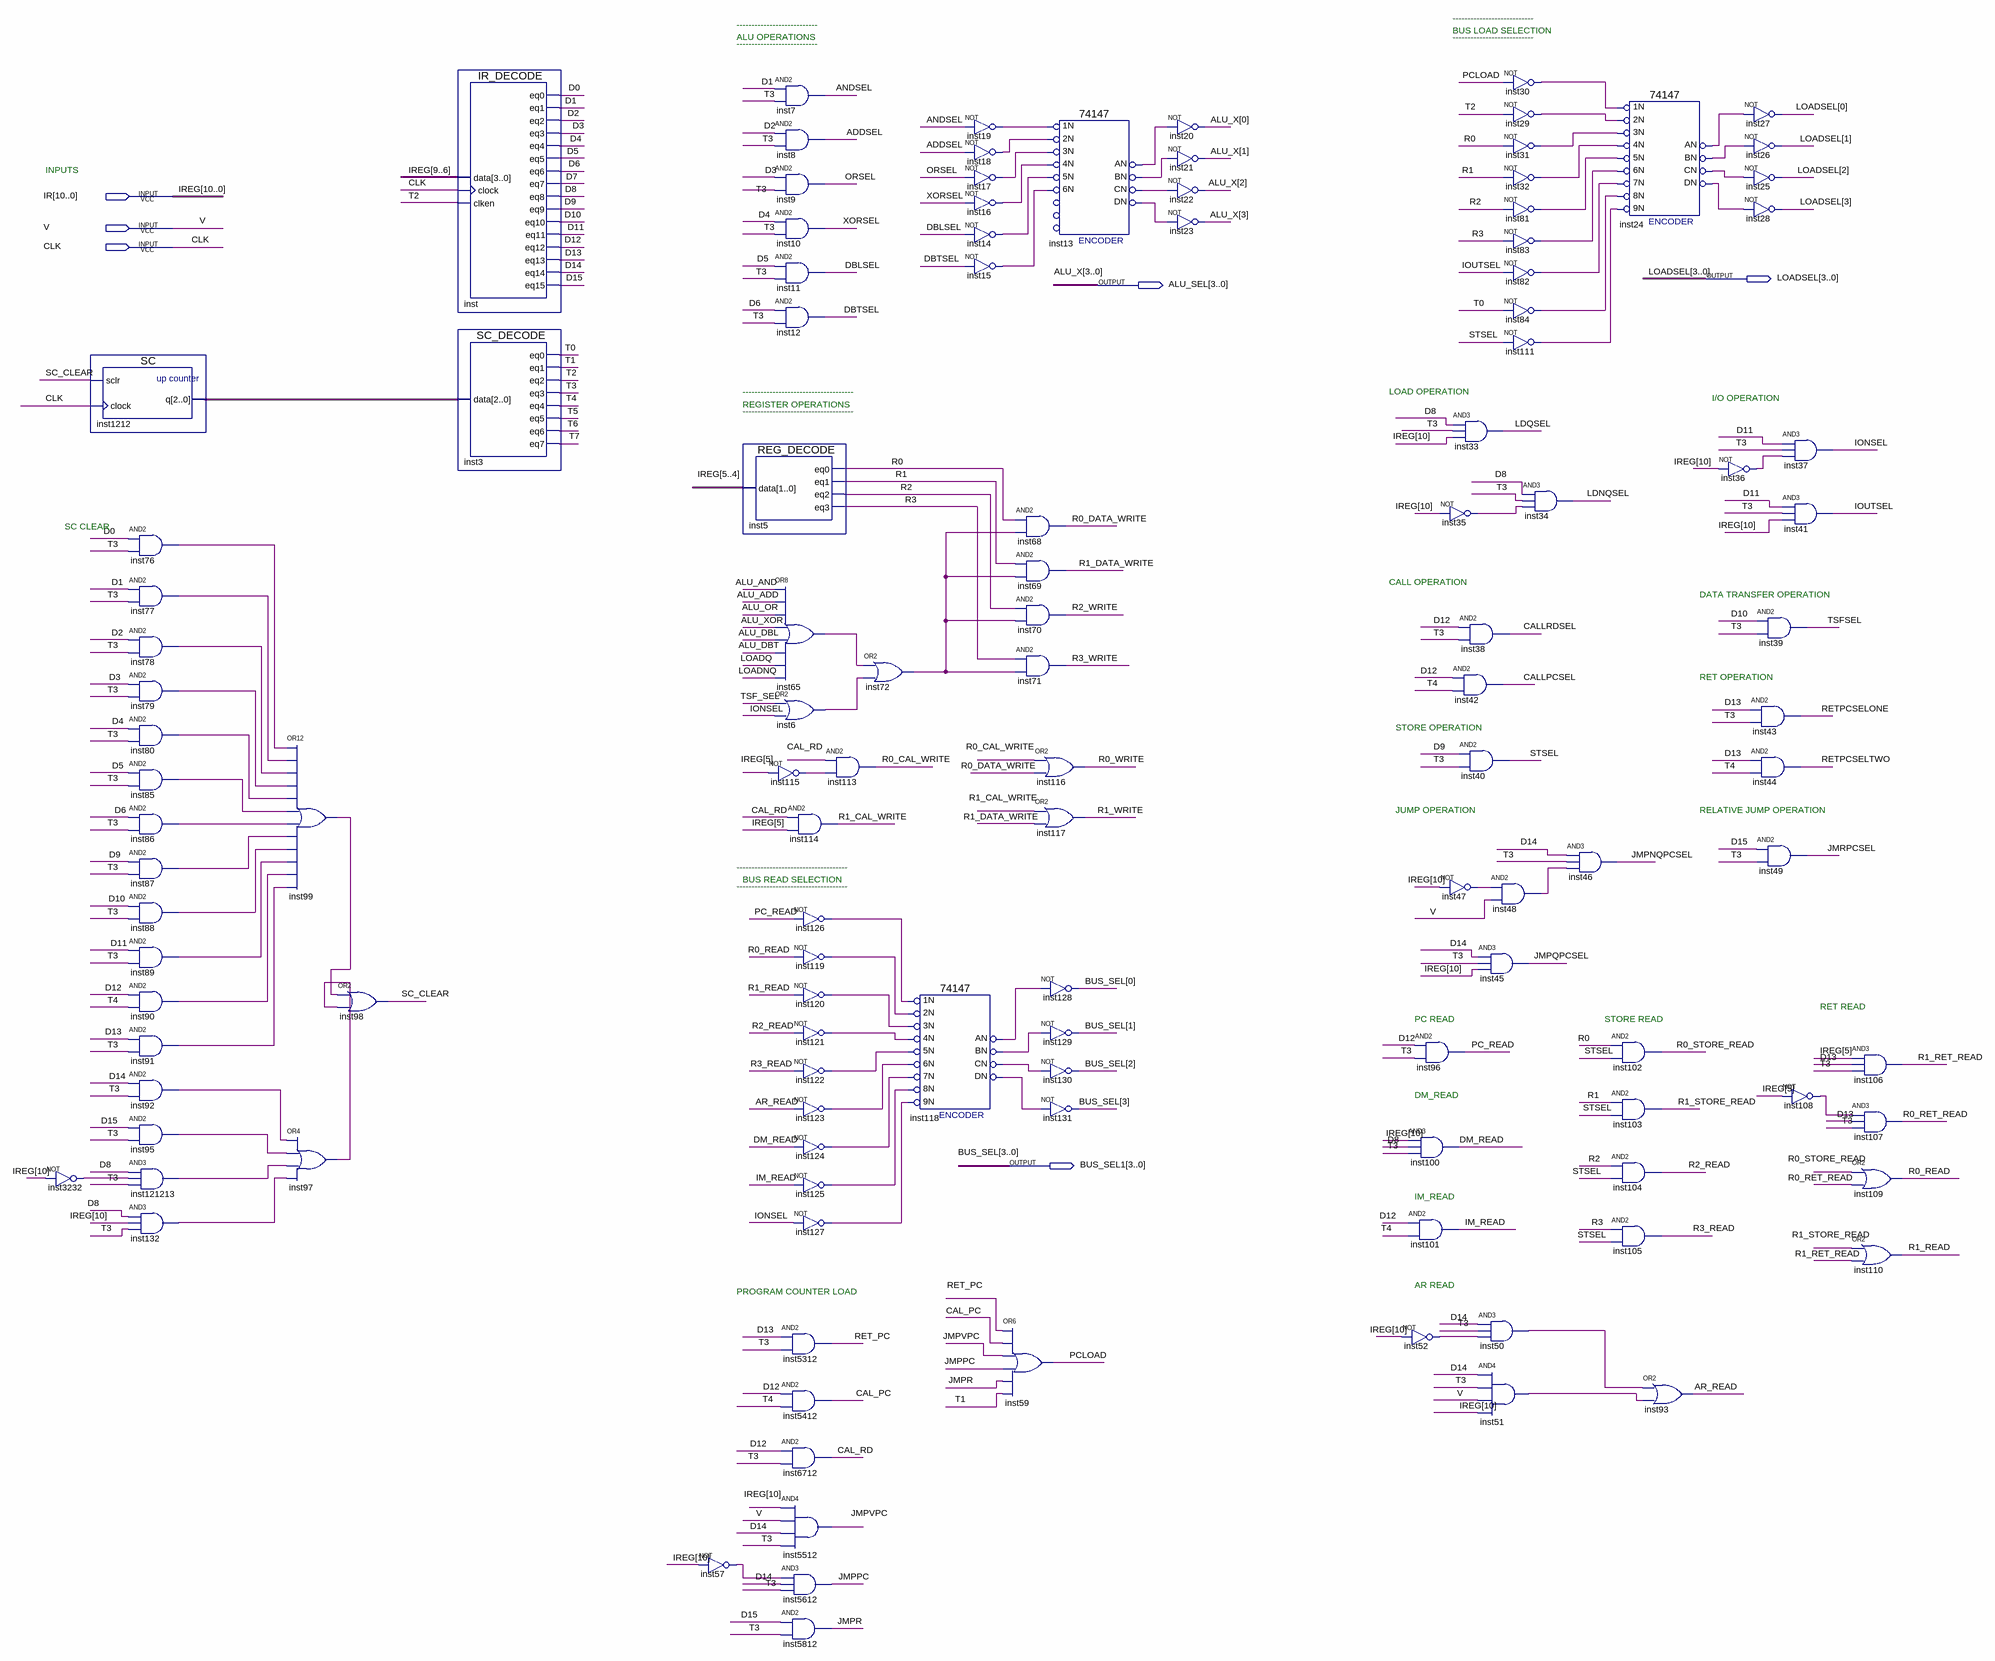
[diagram p0: schematic sheet]
// Quartus schematic ControlUnit.bdf as structural Verilog: 122 symbols, 6 pins
module ControlUnit (
  input  [10:0] IR,
  input  V,
  input  CLK,
  output [3:0] LOADSEL,
  output [3:0] ALU_SEL,
  output [3:0] BUS_SEL1
);

  wire ADDSEL, ALU_ADD, ALU_AND, ALU_DBL, ALU_DBT, ALU_OR, ALU_XOR, ANDSEL, AR_READ, CAL_PC, CAL_RD,
       CALLPCSEL, CALLRDSEL, D0, D1, D2, D3, D4, D5, D6, D7, D8, D9, D10, D11, D12, D13, D14, D15, DBLSEL,
       DBTSEL, DM_READ, IM_READ, inst6_out, inst13_an, inst13_bn, inst13_cn, inst13_dn, inst14_out,
       inst15_out, inst16_out, inst17_out, inst18_out, inst19_out, inst24_an, inst24_bn, inst24_cn,
       inst24_dn, inst29_out, inst30_out, inst31_out, inst32_out, inst35_out, inst36_out, inst47_out,
       inst48_out, inst50_out, inst51_out, inst52_out, inst57_out, inst65_out, inst72_out, inst76_out,
       inst77_out, inst78_out, inst79_out, inst80_out, inst81_out, inst82_out, inst83_out, inst84_out,
       inst85_out, inst86_out, inst87_out, inst88_out, inst89_out, inst90_out, inst91_out, inst92_out,
       inst95_out, inst97_out, inst99_out, inst108_out, inst111_out, inst115_out, inst118_an, inst118_bn,
       inst118_cn, inst118_dn, inst119_out, inst120_out, inst121_out, inst122_out, inst123_out, inst124_out,
       inst125_out, inst126_out, inst127_out, inst132_out, inst3232_out, inst121213_out, IONSEL, IOUTSEL,
       JMPNQPCSEL, JMPPC, JMPQPCSEL, JMPR, JMPVPC, JMRPCSEL, LDNQSEL, LDQSEL, LOADNQ, LOADQ, ORSEL, PC_READ,
       PCLOAD, R0, R0_CAL_WRITE, R0_DATA_WRITE, R0_READ, R0_RET_READ, R0_STORE_READ, R0_WRITE, R1,
       R1_CAL_WRITE, R1_DATA_WRITE, R1_READ, R1_RET_READ, R1_STORE_READ, R1_WRITE, R2, R2_READ, R2_WRITE, R3,
       R3_READ, R3_WRITE, RET_PC, RETPCSELONE, RETPCSELTWO, SC_CLEAR, STSEL, T0, T1, T2, T3, T4, T5, T6, T7,
       TSF_SEL, TSFSEL, XORSEL;
  wire [2:0] inst1212_q;

  not inst3232 (inst3232_out, IR[10]);
  SC inst1212 (.sclr(SC_CLEAR), .clock(CLK), .q(inst1212_q));
  and inst76 (inst76_out, D0, T3);
  and inst77 (inst77_out, D1, T3);
  and inst78 (inst78_out, D2, T3);
  and inst79 (inst79_out, D3, T3);
  and inst80 (inst80_out, D4, T3);
  and inst85 (inst85_out, D5, T3);
  and inst86 (inst86_out, D6, T3);
  and inst87 (inst87_out, D9, T3);
  and inst88 (inst88_out, D10, T3);
  and inst89 (inst89_out, D11, T3);
  and inst90 (inst90_out, D12, T4);
  and inst91 (inst91_out, D13, T3);
  and inst92 (inst92_out, D14, T3);
  and inst95 (inst95_out, D15, T3);
  and inst121213 (inst121213_out, D8, inst3232_out, T3);
  and inst132 (inst132_out, D8, IR[10], T3);
  or inst99 (inst99_out, inst76_out, inst77_out, inst78_out, inst79_out, inst80_out, inst85_out, inst86_out, inst87_out, inst88_out, inst89_out, inst90_out, inst91_out);
  or inst97 (inst97_out, inst92_out, inst95_out, inst121213_out, inst132_out);
  or inst98 (SC_CLEAR, inst99_out, inst97_out);
  IR_DECODE inst (
    .data(IR[9:6]), .clock(CLK), .clken(T2), .eq0(D0), .eq1(D1), .eq2(D2), .eq3(D3), .eq4(D4), .eq5(D5),
    .eq6(D6), .eq7(D7), .eq8(D8), .eq9(D9), .eq10(D10), .eq11(D11), .eq12(D12), .eq13(D13), .eq14(D14),
    .eq15(D15));
  SC_DECODE inst3 (.data(inst1212_q), .eq0(T0), .eq1(T1), .eq2(T2), .eq3(T3), .eq4(T4), .eq5(T5), .eq6(T6), .eq7(T7));
  not inst57 (inst57_out, IR[10]);
  REG_DECODE inst5 (.data(IR[5:4]), .eq0(R0), .eq1(R1), .eq2(R2), .eq3(R3));
  and inst7 (ANDSEL, D1, T3);
  and inst8 (ADDSEL, D2, T3);
  and inst9 (ORSEL, D3, T3);
  and inst10 (XORSEL, D4, T3);
  and inst11 (DBLSEL, D5, T3);
  and inst12 (DBTSEL, D6, T3);
  or inst65 (inst65_out, ALU_AND, ALU_ADD, ALU_OR, ALU_XOR, ALU_DBL, ALU_DBT, LOADQ, LOADNQ);
  or inst6 (inst6_out, TSF_SEL, IONSEL);
  not inst115 (inst115_out, IR[5]);
  and inst114 (R1_CAL_WRITE, CAL_RD, IR[5]);
  not inst126 (inst126_out, PC_READ);
  not inst119 (inst119_out, R0_READ);
  not inst120 (inst120_out, R1_READ);
  not inst121 (inst121_out, R2_READ);
  not inst122 (inst122_out, R3_READ);
  not inst123 (inst123_out, AR_READ);
  not inst124 (inst124_out, DM_READ);
  not inst125 (inst125_out, IM_READ);
  not inst127 (inst127_out, IONSEL);
  and inst5312 (RET_PC, D13, T3);
  and inst5412 (CAL_PC, D12, T4);
  and inst6712 (CAL_RD, D12, T3);
  and inst5512 (JMPVPC, IR[10], V, D14, T3);
  and inst5612 (JMPPC, inst57_out, D14, T3);
  and inst5812 (JMPR, D15, T3);
  and inst113 (R0_CAL_WRITE, CAL_RD, inst115_out);
  or inst72 (inst72_out, inst65_out, inst6_out);
  \74147  inst118 (
    .\1N (inst126_out), .\2N (inst119_out), .\3N (inst120_out), .\6N (inst123_out), .\5N (inst122_out),
    .\4N (inst121_out), .\9N (inst127_out), .\8N (inst125_out), .\7N (inst124_out), .CN(inst118_cn),
    .BN(inst118_bn), .AN(inst118_an), .DN(inst118_dn));
  not inst19 (inst19_out, ANDSEL);
  not inst18 (inst18_out, ADDSEL);
  not inst17 (inst17_out, ORSEL);
  not inst16 (inst16_out, XORSEL);
  not inst14 (inst14_out, DBLSEL);
  not inst15 (inst15_out, DBTSEL);
  or inst59 (PCLOAD, RET_PC, CAL_PC, JMPVPC, JMPPC, JMPR, T1);
  \74147  inst13 (
    .\1N (inst19_out), .\2N (inst18_out), .\3N (inst17_out), .\4N (inst16_out), .\5N (inst14_out),
    .\6N (inst15_out), .AN(inst13_an), .BN(inst13_bn), .CN(inst13_cn), .DN(inst13_dn));
  and inst68 (R0_DATA_WRITE, R0, inst72_out);
  and inst69 (R1_DATA_WRITE, R1, inst72_out);
  and inst70 (R2_WRITE, R2, inst72_out);
  and inst71 (R3_WRITE, R3, inst72_out);
  or inst116 (R0_WRITE, R0_CAL_WRITE, R0_DATA_WRITE);
  or inst117 (R1_WRITE, R1_CAL_WRITE, R1_DATA_WRITE);
  not inst128 (BUS_SEL1[0], inst118_an);
  not inst129 (BUS_SEL1[1], inst118_bn);
  not inst130 (BUS_SEL1[2], inst118_cn);
  not inst131 (BUS_SEL1[3], inst118_dn);
  not inst20 (ALU_SEL[0], inst13_an);
  not inst21 (ALU_SEL[1], inst13_bn);
  not inst22 (ALU_SEL[2], inst13_cn);
  not inst23 (ALU_SEL[3], inst13_dn);
  and inst96 (PC_READ, D12, T3);
  and inst100 (DM_READ, IR[10], D8, T3);
  and inst101 (IM_READ, D12, T4);
  not inst52 (inst52_out, IR[10]);
  and inst33 (LDQSEL, D8, T3, IR[10]);
  not inst35 (inst35_out, IR[10]);
  and inst38 (CALLRDSEL, D12, T3);
  and inst42 (CALLPCSEL, D12, T4);
  and inst40 (STSEL, D9, T3);
  not inst47 (inst47_out, IR[10]);
  not inst30 (inst30_out, PCLOAD);
  not inst29 (inst29_out, T2);
  not inst31 (inst31_out, R0);
  not inst32 (inst32_out, R1);
  not inst81 (inst81_out, R2);
  not inst83 (inst83_out, R3);
  not inst82 (inst82_out, IOUTSEL);
  not inst84 (inst84_out, T0);
  not inst111 (inst111_out, STSEL);
  and inst48 (inst48_out, inst47_out, V);
  and inst45 (JMPQPCSEL, D14, T3, IR[10]);
  and inst50 (inst50_out, D14, T3, inst52_out);
  and inst51 (inst51_out, D14, T3, V, IR[10]);
  and inst34 (LDNQSEL, D8, T3, inst35_out);
  and inst46 (JMPNQPCSEL, D14, T3, inst48_out);
  \74147  inst24 (
    .\1N (inst30_out), .\2N (inst29_out), .\3N (inst31_out), .\4N (inst32_out), .\5N (inst81_out),
    .\6N (inst83_out), .\7N (inst82_out), .\8N (inst84_out), .\9N (inst111_out), .AN(inst24_an),
    .BN(inst24_bn), .CN(inst24_cn), .DN(inst24_dn));
  and inst102 (R0_STORE_READ, R0, STSEL);
  and inst103 (R1_STORE_READ, R1, STSEL);
  and inst104 (R2_READ, R2, STSEL);
  and inst105 (R3_READ, R3, STSEL);
  or inst93 (AR_READ, inst50_out, inst51_out);
  not inst36 (inst36_out, IR[10]);
  not inst27 (LOADSEL[0], inst24_an);
  not inst26 (LOADSEL[1], inst24_bn);
  not inst25 (LOADSEL[2], inst24_cn);
  not inst28 (LOADSEL[3], inst24_dn);
  and inst39 (TSFSEL, D10, T3);
  and inst43 (RETPCSELONE, D13, T3);
  and inst44 (RETPCSELTWO, D13, T4);
  and inst49 (JMRPCSEL, D15, T3);
  and inst37 (IONSEL, D11, T3, inst36_out);
  and inst41 (IOUTSEL, D11, T3, IR[10]);
  not inst108 (inst108_out, IR[5]);
  and inst106 (R1_RET_READ, IR[5], D13, T3);
  and inst107 (R0_RET_READ, inst108_out, D13, T3);
  or inst109 (R0_READ, R0_STORE_READ, R0_RET_READ);
  or inst110 (R1_READ, R1_STORE_READ, R1_RET_READ);

  // Other names for the same wires on the sheet: ALU_X[3:0] = ALU_SEL; BUS_SEL[3:0] = BUS_SEL1; IREG[10:0] = IR

  // Notes on the sheet:
  //   ---------------------------
  //   ---------------------------
  //   BUS LOAD SELECTION
  //   ALU OPERATIONS
  //   ---------------------------
  //   ---------------------------
  //   INPUTS
  //   -------------------------------------
  //   LOAD OPERATION
  //   I/O OPERATION
  //   REGISTER OPERATIONS
  //   -------------------------------------
  //   SC CLEAR
  //   CALL OPERATION
  //   DATA TRANSFER OPERATION
  //   RET OPERATION
  //   STORE OPERATION
  //   JUMP OPERATION
  //   RELATIVE JUMP OPERATION
  //   -------------------------------------
  //   BUS READ SELECTION
  //   -------------------------------------
  //   RET READ
  //   PC READ
  //   STORE READ
  //   DM_READ
  //   IM_READ
  //   AR READ
  //   PROGRAM COUNTER LOAD
endmodule
